# Altium schematic sheet MCU025B_AltRouting_Misc.SchDoc
size 431 x 279 mm; Date: Not shown in title block; ApprovedBy: Not shown in title block; CheckedBy: Not shown in title block; Author: Not shown in title block; CompanyName: Not shown in title block; Engineer: Not shown in title block; Organization: Not shown in title block; Address1: Not shown in title block; Address2: Not shown in title block; Address3: Not shown in title block; Address4: Not shown in title block; DocumentNumber: 3; Revision: Use project parameter SCH_Rev; SheetNumber: 3; SheetTotal: 8; PageSetup: Record=PageOptions|CenterHorizontal=True|CenterVertical=True|PrintScale=1.00|XCorrection=1.00|YCorrection=1.00|PrintKind=0|BorderSize=5000000|LeftOffset=0|BottomOffset=0|Orientation=2|PaperLength=1000|PaperWidth=1000|Scale=100|PaperSource=15|PrintQuality=600|MediaType=1|DitherType=10|PaperKind=Letter|PrintScaleMode=1; CurrentTime: Not shown in title block; CurrentDate: Not shown in title block; Time: Not shown in title block; DocumentFullPathAndName: Not shown in title block; DocumentName: Not shown in title block; ModifiedDate: Not shown in title block; ImagePath: Not shown in title block
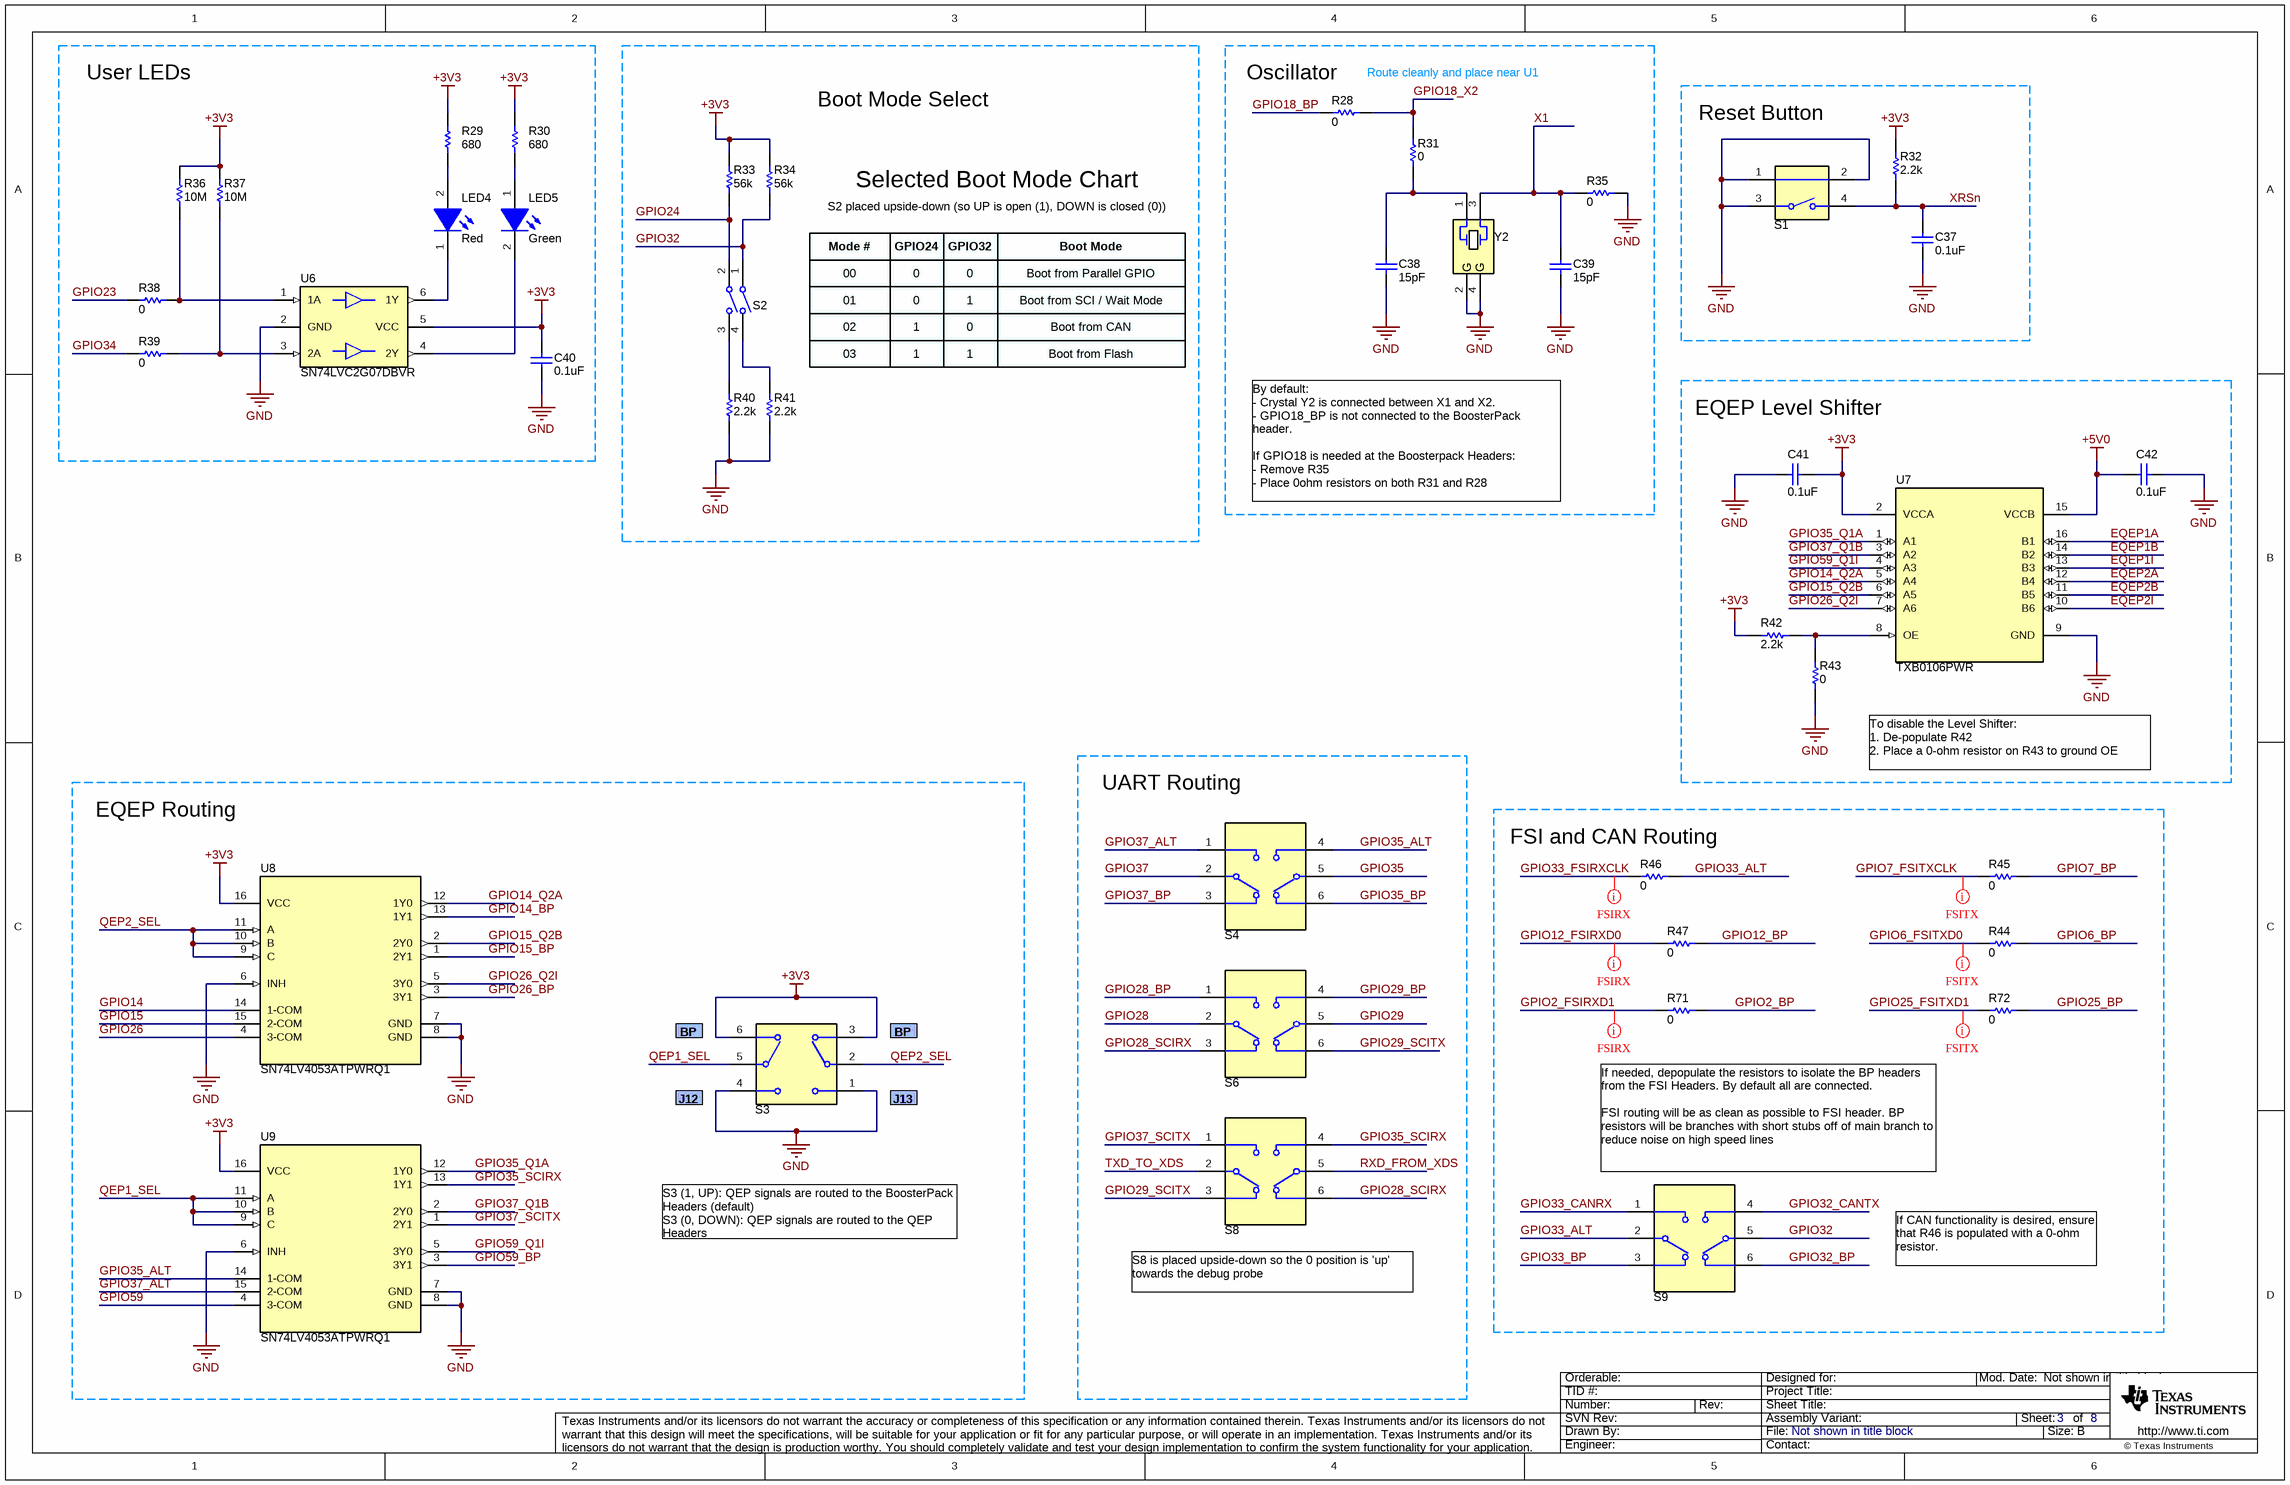
[diagram p0: MCU025B_AltRouting_Misc.SchDoc]

## Parts
C37  ValueDisplayed: 0.1uF  [0402]  (hidden comment: GRM155R71A104KA01D)
C38  ValueDisplayed: 15pF  [0402]  (hidden comment: GRM1555C1H150JA01D)
C39  ValueDisplayed: 15pF  [0402]  (hidden comment: GRM1555C1H150JA01D)
C40  ValueDisplayed: 0.1uF  [0402]  (hidden comment: GRM155R71A104KA01D)
C41  ValueDisplayed: 0.1uF  [0402]  (hidden comment: GRM155R71A104KA01D)
C42  ValueDisplayed: 0.1uF  [0402]  (hidden comment: GRM155R71A104KA01D)
LED4  value Red  [WL-SMCW_RED_0805]  (hidden comment: 150080SS75000)
LED5  value Green  [LED_LTST-C171]  (hidden comment: LTST-C171GKT)
R28  ValueDisplayed: 0  [0603]  (hidden comment: CRCW06030000Z0EA)
R29  ValueDisplayed: 680  [0402]  (hidden comment: CRCW0402680RJNED)
R30  ValueDisplayed: 680  [0402]  (hidden comment: CRCW0402680RJNED)
R31  ValueDisplayed: 0  [0603]  (hidden comment: CRCW06030000Z0EA)
R32  ValueDisplayed: 2.2k  [0402]  (hidden comment: CRCW04022K20JNED)
R33  ValueDisplayed: 56k  [0402]  (hidden comment: CRCW040256K0JNED)
R34  ValueDisplayed: 56k  [0402]  (hidden comment: CRCW040256K0JNED)
R35  ValueDisplayed: 0  [0603]  (hidden comment: CRCW06030000Z0EA)
R36  ValueDisplayed: 10M  [0402]  (hidden comment: CRCW040210M0JNED)
R37  ValueDisplayed: 10M  [0402]  (hidden comment: CRCW040210M0JNED)
R38  ValueDisplayed: 0  [0603]  (hidden comment: CRCW06030000Z0EA)
R39  ValueDisplayed: 0  [0603]  (hidden comment: CRCW06030000Z0EA)
R40  ValueDisplayed: 2.2k  [0402]  (hidden comment: CRCW04022K20JNED)
R41  ValueDisplayed: 2.2k  [0402]  (hidden comment: CRCW04022K20JNED)
R42  ValueDisplayed: 2.2k  [0603]  (hidden comment: CRCW06032K20JNEA)
R43  ValueDisplayed: 0  [0603]  (hidden comment: CRCW06030000Z0EA)
R44  ValueDisplayed: 0  [0603]  (hidden comment: CRCW06030000Z0EA)
R45  ValueDisplayed: 0  [0603]  (hidden comment: CRCW06030000Z0EA)
R46  ValueDisplayed: 0  [0603]  (hidden comment: CRCW06030000Z0EA)
R47  ValueDisplayed: 0  [0603]  (hidden comment: CRCW06030000Z0EA)
R71  ValueDisplayed: 0  [0603]  (hidden comment: CRCW06030000Z0EA)
R72  ValueDisplayed: 0  [0603]  (hidden comment: CRCW06030000Z0EA)
S1  1188E-1K2-V-TR  [SW_1188E]  (value not drawn)
S2  218-2LPST  [SW_218-2LP]  (value not drawn)
S3  CAS-D20TA  [SW_CAS-D20TA]  (value not drawn)
S4  CAS-220TA  [SW_CAS-220TA]  (value not drawn)
S6  CAS-220TA  [SW_CAS-220TA]  (value not drawn)
S8  CAS-220TA  [SW_CAS-220TA]  (value not drawn)
S9  CAS-220TA  [SW_CAS-220TA]  (value not drawn)
U6  SN74LVC2G07DBVR  [DBV0006A_N]
U7  TXB0106PWR  [PW0016A_N]
U8  SN74LV4053ATPWRQ1  [PW0016A_L]
U9  SN74LV4053ATPWRQ1  [PW0016A_L]
Y2  ECS-200-18-30B-AGN-TR  [ECS_ECX-53B]  (value not drawn)

## Nets
+3V3: C40.2 C41.1 R29.2 R30.2 R32.2 R33.2 R34.2 R36.2 R37.2 R42.1 S3.3 S3.6 U6.5(VCC) U7.2(VCCA) U8.16(VCC) U9.16(VCC)
+5V0: C42.2 U7.15(VCCB)
GND: C37.1 C38.2 C39.2 C40.1 C41.2 C42.1 R35.2 R40.1 R41.1 R43.1 S1.1 S1.2 S1.3 S3.1 S3.4 U6.2(GND) U7.9(GND) U8.6(INH) U8.7(GND) U8.8(GND) U9.6(INH) U9.7(GND) U9.8(GND) Y2.2(GND) Y2.4(GND)
EQEP1A: U7.16(B1)
EQEP1B: U7.14(B2)
EQEP1I: U7.13(B3)
EQEP2A: U7.12(B4)
EQEP2B: U7.11(B5)
EQEP2I: U7.10(B6)
GPIO2_BP: R71.2
GPIO2_FSIRXD1: R71.1
GPIO6_BP: R44.2
GPIO6_FSITXD0: R44.1
GPIO7_BP: R45.2
GPIO7_FSITXCLK: R45.1
GPIO12_BP: R47.2
GPIO12_FSIRXD0: R47.1
GPIO14: U8.14(1-COM)
GPIO14_BP: U8.13(1Y1)
GPIO14_Q2A: U7.5(A4) U8.12(1Y0)
GPIO15: U8.15(2-COM)
GPIO15_BP: U8.1(2Y1)
GPIO15_Q2B: U7.6(A5) U8.2(2Y0)
GPIO18_BP: R28.1
GPIO18_X2: R28.2 R31.2
GPIO23: R38.1
GPIO24: R33.1 S2.2
GPIO25_BP: R72.2
GPIO25_FSITXD1: R72.1
GPIO26: U8.4(3-COM)
GPIO26_BP: U8.3(3Y1)
GPIO26_Q2I: U7.7(A6) U8.5(3Y0)
GPIO28: S6.2
GPIO28_BP: S6.1
GPIO28_SCIRX: S6.3 S8.6
GPIO29: S6.5
GPIO29_BP: S6.4
GPIO29_SCITX: S6.6 S8.3
GPIO32: R34.1 S2.1 S9.5
GPIO32_BP: S9.6
GPIO32_CANTX: S9.4
GPIO33_ALT: R46.2 S9.2
GPIO33_BP: S9.3
GPIO33_CANRX: S9.1
GPIO33_FSIRXCLK: R46.1
GPIO34: R39.1
GPIO35: S4.5
GPIO35_ALT: S4.4 U9.14(1-COM)
GPIO35_BP: S4.6
GPIO35_Q1A: U7.1(A1) U9.12(1Y0)
GPIO35_SCIRX: S8.4 U9.13(1Y1)
GPIO37: S4.2
GPIO37_ALT: S4.1 U9.15(2-COM)
GPIO37_BP: S4.3
GPIO37_Q1B: U7.3(A2) U9.2(2Y0)
GPIO37_SCITX: S8.1 U9.1(2Y1)
GPIO59: U9.4(3-COM)
GPIO59_BP: U9.3(3Y1)
GPIO59_Q1I: U7.4(A3) U9.5(3Y0)
QEP1_SEL: S3.5(C) U9.9(C) U9.10(B) U9.11(A)
QEP2_SEL: S3.2(C) U8.9(C) U8.10(B) U8.11(A)
RXD_FROM_XDS: S8.5
TXD_TO_XDS: S8.2
X1: C39.1 R35.1 Y2.3
XRSn: C37.2 R32.1 S1.4
NetC38_1: C38.1 R31.1 Y2.1
NetLED4_1: LED4.1(K) U6.6(1Y)
NetLED4_2: LED4.2(A) R29.1
NetLED5_1: LED5.1(A) R30.1
NetLED5_2: LED5.2(K) U6.4(2Y)
NetR36_1: R36.1 R38.2 U6.1(1A)
NetR37_1: R37.1 R39.2 U6.3(2A)
NetR40_2: R40.2 S2.3
NetR41_2: R41.2 S2.4
NetR42_2: R42.2 R43.2 U7.8(OE)

## Layout directives
net class FSIRX: GPIO2_FSIRXD1, GPIO12_FSIRXD0, GPIO33_FSIRXCLK
net class FSITX: GPIO6_FSITXD0, GPIO7_FSITXCLK, GPIO25_FSITXD1

## Notes on the sheet
- User LEDs
- Boot Mode Select
- (near R28) Oscillator
- (near R28) Route cleanly and place near U1
- Reset Button
- Selected Boot Mode Chart
- (near R34) S2 placed upside-down (so UP is open (1), DOWN is closed (0))
- Mode #
- 00
- 01
- GPIO24
- 0
- GPIO32
- 1
- Boot Mode
- Boot from Parallel GPIO
- Boot from SCI / Wait Mode
- 02
- 03
- Boot from CAN
- Boot from Flash
- EQEP Level Shifter
- By default:
  - Crystal Y2 is connected between X1 and X2.
  - GPIO18_BP is not connected to the BoosterPack header.
  If GPIO18 is needed at the Boosterpack Headers:
  - Remove R35
  - Place 0ohm resistors on both R31 and R28
- To disable the Level Shifter:
  1. De-populate R42
  2. Place a 0-ohm resistor on R43 to ground OE
- EQEP Routing
- UART Routing
- (near R46) FSI and CAN Routing
- BP
- J12
- J13
- If needed, depopulate the resistors to isolate the BP headers from the FSI Headers. By default all are connected.
  FSI routing will be as clean as possible to FSI header. BP resistors will be branches with short stubs off of main branch to reduce noise on high speed lines
- S3 (1, UP): QEP signals are routed to the BoosterPack Headers (default)
  S3 (0, DOWN): QEP signals are routed to the QEP Headers
- S8 is placed upside-down so the 0 position is 'up' towards the debug probe
- If CAN functionality is desired, ensure that R46 is populated with a 0-ohm resistor.
- Drawn By:
- SVN Rev:
- Number:
- TID #:
- Orderable:
- Rev:
- Sheet Title:
- File:
- Project Title:
- Designed for:
- Assembly Variant:
- Mod. Date:
- Sheet:
- Size:
- of
- B
- http://www.ti.com
- Texas Instruments and/or its licensors do not warrant the accuracy or completeness of this specification or any information contained therein. Texas Instruments and/or its licensors do not warrant that this design will meet the specifications, will be suitable for your application or fit for any particular purpose, or will operate in an implementation. Texas Instruments and/or its licensors do not warrant that the design is production worthy. You should completely validate and test your design implementation to confirm the system functionality for your application.
- Engineer:
- Contact:
- © Texas Instruments
- (in symbol CMP-0080365-1) G

## Library data of the parts
C37 C40-C42 = CMP-0006629-2: CAP, CERM, 0.1 uF, 10 V, +/- 10%, X7R, 0402; Manufacturer: MuRata; Polarized: N; Value: 0.1uF; U/M: EA; Cap_F: 100nF; Value1: Unknown; VDC_V: 10V; TaMin_C: -55°C; TaMax_C: 125°C; SizeArea_mm2: 0.5; SizeAreaWB_mm2: 3; SizeX_mm: 1; SizeZ_mm: 0.6; AEC Category: Q200; CompType: Capacitor; PartNumber: GRM155R71A104KA01D; PackageReference: 0402; RoHS: Y; Tolerance_%: 10%; Value2: 10V; MountType: SMT; Technology: Ceramic; TempCo: X7R; Cap_Case: 0402; SizeY_mm: 0.5; Published: 2008-06-19; Publisher: Texas Instruments; LatestRevisionDate: 2017-03-09; ComponentLink1Description: Datasheet link; ComponentLink1URL: http://search.murata.co.jp/Ceramy/PnsearchViewAction.do?HnOFG=ON&HnNFG=ON&SEL_CNT=50&sLang=en&sKey=GRM155R71A104KA01D&x=9&y=9&search=startwith; Supplier 1: Digi-Key; Supplier Part Number 1: GRM155R71A104KA01D-ND; Supplier 2: Newark; Supplier Part Number 2: 14T3278; Supplier 3: Mouser; Supplier Part Number 3: 81-GRM155R71A104KA1D; AEC Qualified: ?
C38 C39 = CMP-0006420-2: CAP, CERM, 15 pF, 50 V, +/- 5%, C0G/NP0, 0402; Manufacturer: MuRata; Polarized: N; Value: 15pF; U/M: EA; Value1: Unknown; VDC_V: 50V; TaMin_C: -55°C; TaMax_C: 125°C; SizeArea_mm2: 0.5; SizeAreaWB_mm2: 3; SizeX_mm: 1; SizeZ_mm: 0.6; AEC Category: Q200; CompType: Capacitor; PartNumber: GRM1555C1H150JA01D; PackageReference: 0402; RoHS: Y; Cap_F: 15pF; Tolerance_%: 5%; Value2: 50V; MountType: SMT; Technology: Ceramic; TempCo: C0G/NP0; Cap_Case: 0402; SizeY_mm: 0.5; Published: 2008-06-19; Publisher: Texas Instruments; LatestRevisionDate: 2017-03-09; ComponentLink1Description: Datasheet link; ComponentLink1URL: http://search.murata.co.jp/Ceramy/PnsearchViewAction.do?HnOFG=ON&HnNFG=ON&SEL_CNT=50&sLang=en&sKey=GRM1555C1H150JA01D&x=9&y=9&search=startwith; Supplier 1: Mouser; Supplier Part Number 1: 81-GRM1555C1H150JA1D; AEC Qualified: ?
LED4 = CMP-0002951-2: LED, Red, SMD; Manufacturer: Wurth Elektronik; Type: AlInGaP; Vf_V: 1.9V; Io_A: 30mA; Vr_V: 5V; Ir_A: 25µA; Tjmax_C: 85°C; Power_TotalModule: 72mW; Value1: 0.072W; Angle: 140; U/M: EA; CompType: LED; PartNumber: 150080SS75000; MountType: SMT; RoHS: Y; PackageReference: LED_0805; Value2: 1.9V; Color: Red; Published: 2008-07-11; Publisher: Texas Instruments; ComponentLink1URL: http://katalog.we-online.de/led/datasheet/150080SS75000.pdf; ComponentLink1Description: Datasheet link; LatestRevisionDate: 2017-03-09; Supplier 1: Digi-Key; Supplier Part Number 1: 732-4985-1-ND; Supplier 2: Newark; Supplier Part Number 2: 95W3802; Supplier 3: Mouser; Supplier Part Number 3: 710-150080SS75000
LED5 = CMP-0002830-2: LED, Green, SMD; Manufacturer: Lite-On; Type: AlInGaP; Vf_V: 2.1V; Io_A: 20A; Value1: W; SizeAreaWB_mm2: 6.75; SizeArea_mm2: 2.5; SizeX_mm: 2; SizeY_mm: 1.25; SizeZ_mm: 1.2; U/M: EA; CompType: LED; PartNumber: LTST-C171GKT; MountType: SMT; RoHS: Y; PackageReference: 0805 LED; Value2: 2.1V; Color: green; Published: 2008-07-11; Publisher: Texas Instruments; ComponentLink1URL: https://sps06.itg.ti.com/sites/KMS/crossdivteams/altium/docs/ComponentDatasheets/LTST-C171GKT.pdf; ComponentLink1Description: Datasheet link; LatestRevisionDate: 2017-03-09; Supplier 1: Digi-Key; Supplier Part Number 1: 160-1423-1-ND; Supplier 2: Mouser; Supplier Part Number 2: 859-LTST-C171GKT
R28 R31 R35 R38 R39 R43-R47 R71 R72 = CMP-0025697-4: RES, 0, 5%, 0.1 W, AEC-Q200 Grade 0, 0603; Manufacturer: Vishay-Dale; Value: 0; Value_Code: 0000; Power_W: 100mW; Value2: 0.1W; VDC_V: 75V; TempCo: 200 ppm/C; SizeArea_mm2: 1.28; SizeX_mm: 1.6; SizeY_mm: 0.8; SizeZ_mm: 1; EIA_Code: E24; AEC Category: Q200; AEC Qualified: Y; CompType: Resistor; PartNumber: CRCW06030000Z0EA; PackageReference: 0603; RoHS: E; Res_ohm: 0; Tolerance_%: 5%; Value1: 5%; MountType: SMT; Technology: Thick Film; ComponentLink1Description: Datasheet link; ComponentLink1URL: http://www.vishay.com/docs/20035/dcrcwe3.pdf; Supplier 1: Digi-Key; Supplier Part Number 1: 541-0.0GCT-ND; Supplier 2: Newark; Supplier Part Number 2: 52K8014; Supplier 3: Mouser; Supplier Part Number 3: 71-CRCW0603-0-E3; AEC Grade: 0
R29 R30 = CMP-0026962-3: RES, 680, 5%, 0.063 W, AEC-Q200 Grade 0, 0402; Manufacturer: Vishay-Dale; Power_W: 63mW; TempCo: 200 ppm/C; Value_Code: 680R; Value: 680; EIA_Code: E24; SizeX_mm: 1; SizeY_mm: 0.5; SizeZ_mm: 0.6; Value2: 0.063W; CompType: Resistor; AEC Qualified: Y; VDC_V: 50V; AEC Category: Q200; AEC Grade: 0; Supplier Part Number 2: 59M6744; Supplier 2: Newark; Supplier Part Number 3: 71-CRCW0402J-680-E3; Supplier 3: Mouser; RoHS: E; Value1: 5%; MountType: SMT; Supplier 1: Digi-Key; PackageReference: 0402; Tolerance_%: 5%; Res_ohm: 680; SizeArea_mm2: 0.5; PartNumber: CRCW0402680RJNED; ComponentLink1Description: Datasheet link; Supplier Part Number 1: 541-680JCT-ND; Technology: Thick Film; ComponentLink1URL: http://www.vishay.com/docs/20035/dcrcwe3.pdf
R32 R40 R41 = CMP-0026890-5: RES, 2.2 k, 5%, 0.063 W, AEC-Q200 Grade 0, 0402; Manufacturer: Vishay-Dale; Value: 2.2k; Value_Code: 2k20; Power_W: 63mW; Value2: 0.063W; VDC_V: 50V; TempCo: 200 ppm/C; SizeArea_mm2: 0.5; SizeX_mm: 1; SizeZ_mm: 0.6; EIA_Code: E24; AEC Category: Q200; AEC Qualified: Y; AEC Grade: 0; CompType: Resistor; PartNumber: CRCW04022K20JNED; PackageReference: 0402; RoHS: E; Res_ohm: 2.2k; Tolerance_%: 5%; Value1: 5%; MountType: SMT; Technology: Thick Film; SizeY_mm: 0.5; ComponentLink1Description: Datasheet link; ComponentLink1URL: http://www.vishay.com/docs/20035/dcrcwe3.pdf; Supplier 1: Digi-Key; Supplier Part Number 1: 541-2.2KJCT-ND; Supplier 2: Newark; Supplier Part Number 2: 59M6710; Supplier 3: Mouser; Supplier Part Number 3: 71-CRCW0402J-2.2K-E3
R33 R34 = CMP-0026949-3: RES, 56 k, 5%, 0.063 W, AEC-Q200 Grade 0, 0402; Manufacturer: Vishay-Dale; Value: 56k; Value_Code: 56k0; Power_W: 63mW; Value2: 0.063W; VDC_V: 50V; TempCo: 200 ppm/C; SizeArea_mm2: 0.5; SizeX_mm: 1; SizeZ_mm: 0.6; EIA_Code: E24; AEC Category: Q200; AEC Qualified: Y; AEC Grade: 0; CompType: Resistor; PartNumber: CRCW040256K0JNED; PackageReference: 0402; RoHS: E; Res_ohm: 56k; Tolerance_%: 5%; Value1: 5%; MountType: SMT; Technology: Thick Film; SizeY_mm: 0.5; ComponentLink1Description: Datasheet link; ComponentLink1URL: http://www.vishay.com/docs/20035/dcrcwe3.pdf; Supplier 1: Digi-Key; Supplier Part Number 1: 541-56KJCT-ND; Supplier 2: Newark; Supplier Part Number 2: 89M6680; Supplier 3: Mouser; Supplier Part Number 3: 71-CRCW0402J-56K-E3
R36 R37 = CMP-0026826-2: RES, 10 M, 5%, 0.063 W, AEC-Q200 Grade 0, 0402; Manufacturer: Vishay-Dale; Value: 10Meg; Value_Code: 10M0; Power_W: 63mW; Value2: 0.063W; VDC_V: 50V; TempCo: 200 ppm/C; SizeArea_mm2: 0.5; SizeX_mm: 1; SizeZ_mm: 0.6; EIA_Code: E24; AEC Category: Q200; AEC Qualified: Y; AEC Grade: 0; CompType: Resistor; PartNumber: CRCW040210M0JNED; PackageReference: 0402; RoHS: E; Res_ohm: 10M; Tolerance_%: 5%; Value1: 5%; MountType: SMT; Technology: Thick Film; SizeY_mm: 0.5; ComponentLink1Description: Datasheet link; ComponentLink1URL: http://www.vishay.com/docs/20035/dcrcwe3.pdf; Supplier 1: Digi-Key; Supplier Part Number 1: 541-10MJCT-ND; Supplier 2: Newark; Supplier Part Number 2: 59M6697; Supplier 3: Mouser; Supplier Part Number 3: 71-CRCW0402J-10M-E3
R42 = CMP-0025769-4: RES, 2.2 k, 5%, 0.1 W, AEC-Q200 Grade 0, 0603; Manufacturer: Vishay-Dale; Value: 2.2k; Value_Code: 2k20; Power_W: 100mW; Value2: 0.1W; VDC_V: 75V; TempCo: 200 ppm/C; SizeArea_mm2: 1.28; SizeX_mm: 1.6; SizeY_mm: 0.8; SizeZ_mm: 1; EIA_Code: E24; AEC Category: Q200; AEC Qualified: Y; AEC Grade: 0; CompType: Resistor; PartNumber: CRCW06032K20JNEA; PackageReference: 0603; RoHS: E; Res_ohm: 2.2k; Tolerance_%: 5%; Value1: 5%; MountType: SMT; Technology: Thick Film; ComponentLink1Description: Datasheet link; ComponentLink1URL: http://www.vishay.com/docs/20035/dcrcwe3.pdf; Supplier 1: Digi-Key; Supplier Part Number 1: 541-2.2KGCT-ND; Supplier 2: Newark; Supplier Part Number 2: 59M6776; Supplier 3: Farnell; Supplier Part Number 3: 1652868
S1 = CMP-0002328-1: Switch, SPST, 0.05 A, 12 VDC, SMD; Manufacturer: Diptronics; SizeAreaWB_mm2: 53.9; SizeArea_mm2: 27.3; SizeX_mm: 7.8; SizeY_mm: 3.5; VDC_V: 12V; PositionCount: 1; CurrentRating_mA: 50A; PartNumber: 1188E-1K2-V-TR; MountType: SMT; SizeZ_mm: 3.5; ComponentLink1Description: Datasheet URL; ComponentLink1URL: http://www.dip.com.tw/en/en-product-information/en-switch004/item/download/1976_b080c057386714e3a6604cbe658b9df3; RoHS: Y; Circuit: SPST; Orientation: Side Actuated; CompType: Switch; PackageReference: 7.8x3.5mm; Publisher: Texas Instruments; LatestRevisionDate: 2017-03-09
S2 = CMP-0002230-1: Switch, SPST, 2 Pos, 25mA, 24VDC, SMD; Manufacturer: CTS Electrocomponents; VDC_V: 24V; SwitchFunction: Off-On; PositionCount: 2; CurrentRating_mA: 25A; PartNumber: 218-2LPST; MountType: SMT; ComponentLink1Description: Datasheet Link; ComponentLink1URL: http://www.ctscorp.com/components/Datasheets/218.pdf; RoHS: Y; Circuit: SPST; Orientation: Top Actuated; CompType: Switch; PackageReference: 3.71x5.8mm; Publisher: Texas Instruments; LatestRevisionDate: 2017-03-09; Supplier 1: Digi-Key; Supplier Part Number 1: CT2182LPST-ND; Supplier 2: Mouser; Supplier Part Number 2: 774-2182LPST
S3 = CMP-0002233-1: Switch, Dual SPDT,  2 Pos, 0.1A, 6VDC, SMD; Manufacturer: Copal Electronics; VDC_V: 6V; SwitchFunction: On-On; PositionCount: 2; CurrentRating_mA: 100A; PartNumber: CAS-D20TA; MountType: SMT; ComponentLink1Description: Datasheet Link; ComponentLink1URL: http://www.nidec-copal-electronics.com/e/catalog/switch/cas.pdf; RoHS: Y; Circuit: SPDT; Orientation: Top Actuated; CompType: Switch; PackageReference: 5.4x3.9mm; Publisher: Texas Instruments; LatestRevisionDate: 2017-03-09; Supplier 1: Digi-Key; Supplier Part Number 1: CASD20JCT-ND
S4 S6 S8 S9 = CMP-0002123-2: SLIDE SWITCH DPDT  .1A, SMT; Manufacturer: Copal Electronics; VDC_V: 6V; SwitchFunction: On-On; PositionCount: 2; CurrentRating_mA: 100A; PartNumber: CAS-220TA; MountType: SMT; ComponentLink1Description: Datasheet URL; ComponentLink1URL: http://copal-electronics.info/en/0008e/02462.pdf; RoHS: Y; Circuit: DPDT; Orientation: Horizontal; CompType: Switch; PackageReference: SWITCH, 5.4x2.5x3.9mm; Publisher: Texas Instruments; LatestRevisionDate: 2017-03-09; Supplier 1: Digi-Key; Supplier Part Number 1: CAS220JCT-ND
U6 = CMP-0051789-2: Dual Buffer/Driver with Open-Drain Output, DBV0006A, LARGE T&R; Manufacturer: Texas Instruments; VCC(Min)(V): 1.65; VCC(Max)(V): 5.5; Output Type: CMOS; ICC @ Nom Voltage(Max)(mA): 0.01; Input Type: CMOS/TTL; Bits(#): 2; F @ Nom Voltage(Max)(Mhz): 150; Rating: Catalog; Technology Family: LVC; Voltage(Nom)(V): 1.8,2.5,3.3,5; Schmitt Trigger: No; Output Drive (IOL/IOH)(Max)(mA): 32/-32; tpd @ Nom Voltage(Max)(ns): 8.6,4.4,3.7,2.9; Logic: True; Sub-Family: Inverting Buffer/Driver; AEC Category: Q200; AEC Qualified: N; CompType: IC; Green_Lifecycle: Active; Green_REACh: Passed; SizeArea_mm2: 8.12; SizeAreaWB_mm2: 14.82; SizeX_mm: 2.8; SizeY_mm: 2.9; SizeZ_mm: 1.45; DatasheetVersion: SCES308K; PackageReference: DBV0006A; Generic Part Number: SN74LVC2G07; Operating Temperature Range(C): -40 to 125; 3-State Output: No; ComponentLink1Description: Datasheet Link; ComponentLink1URL: http://www.ti.com/lit/ds/symlink/sn74lvc2g07.pdf; ComponentLink2Description: Product Folder; ComponentLink2URL: http://www.ti.com/product/sn74lvc2g07; ComponentLink3Description: Online Datasheet; ComponentLink3URL: http://www.ti.com/product/sn74lvc2g07/datasheet; Green_EU RoHS-2: Passed; Green_EU RoHS: Passed; MountType: SMT; PackageDescription: SOT-23-6; PartNumber: SN74LVC2G07DBVR; RoHS: Y
U7 = CMP-0067443-1: 6-Bit Bidirectional Voltage-Level Translator with Auto Direction Sensing and +/-15-kV ESD Protect, PW0016A (TSSOP-16); Manufacturer: Texas Instruments; SizeArea_mm2: 32.0; SizeAreaWB_mm2: 58.8; SizeX_mm: 6.4; SizeY_mm: 5.0; SizeZ_mm: 1.2; CompType: IC; U/M: EA; Green_Lifecycle: Active; Green_REACh: Passed; PartNumber: TXB0106PWR; PackageReference: PW0016A; PackageDescription: TSSOP-16; MountType: SMT; ComponentLink1Description: Datasheet Link; ComponentLink1URL: http://www.ti.com/lit/ds/symlink/txb0106.pdf; RoHS: Y; Publisher: Texas Instruments; LatestRevisionDate: 2017-06-09; Alternate Manufacturer: Texas Instruments; Green_EU RoHS: Passed; Green_EU RoHS-2: Passed; Footprint Path 6: C:\AltiumLibraries\Footprints\TI\.PcbLib
U8 U9 = CMP-0076549-1: TRIPLE 2-CHANNEL ANALOG MULTIPLEXER/DEMULTIPLEXER, PW0016A (TSSOP-16); Manufacturer: Texas Instruments; SizeAreaWB_mm2: 58.8; SizeArea_mm2: 32.0; SizeZ_mm: 1.2; SizeY_mm: 5.0; U/M: EA; CompType: IC; SizeX_mm: 6.4; ComponentLink1Description: Datasheet Link; RoHS: Y; PackageReference: PW0016A; PartNumber: SN74LV4053ATPWRQ1; Publisher: Texas Instruments; PackageDescription: TSSOP-16; Alternate Manufacturer: Texas Instruments; ComponentLink1URL: http://www.ti.com/lit/ds/symlink/sn74lv4053a-q1.pdf; LatestRevisionDate: 2017-06-09; MountType: SMT
Y2 = CMP-0080365-1: Crystal, 20 MHz, 25 ppm, 18, SMD; Manufacturer: ECS Inc.; Frequency Stability: 30 ppm; AEC Qualified: N; Frequency Tolerance: 25 ppm; AEC Category: Q200; TaMax_C: 85°C; Frequency_Fixed: 20MHz; TaMin_C: -40°C; Load Capacitance: 18; ComponentLink1Description: Datasheet Link; RoHS: Y; Supplier 1: Digi-Key; PackageReference: 5x3.2mm; PartNumber: ECS-200-18-30B-AGN-TR; Supplier Part Number 2: 520-200-18-30B-AGNT; Supplier 2: Mouser; AEC Grade: N/A; ComponentLink1URL: http://www.ecsxtal.com/store/pdf/ecx_53b.pdf; CompType: Crystal; Supplier Part Number 1: XC2693CT-ND; MountType: SMT